# EAGLE design ACme++ (EAGLE 6.5.0)
AUTHOR: Brad Campbell; REV: A; TITLE: ACme++

## Sheet 1 of 4: EPIC & Programmer
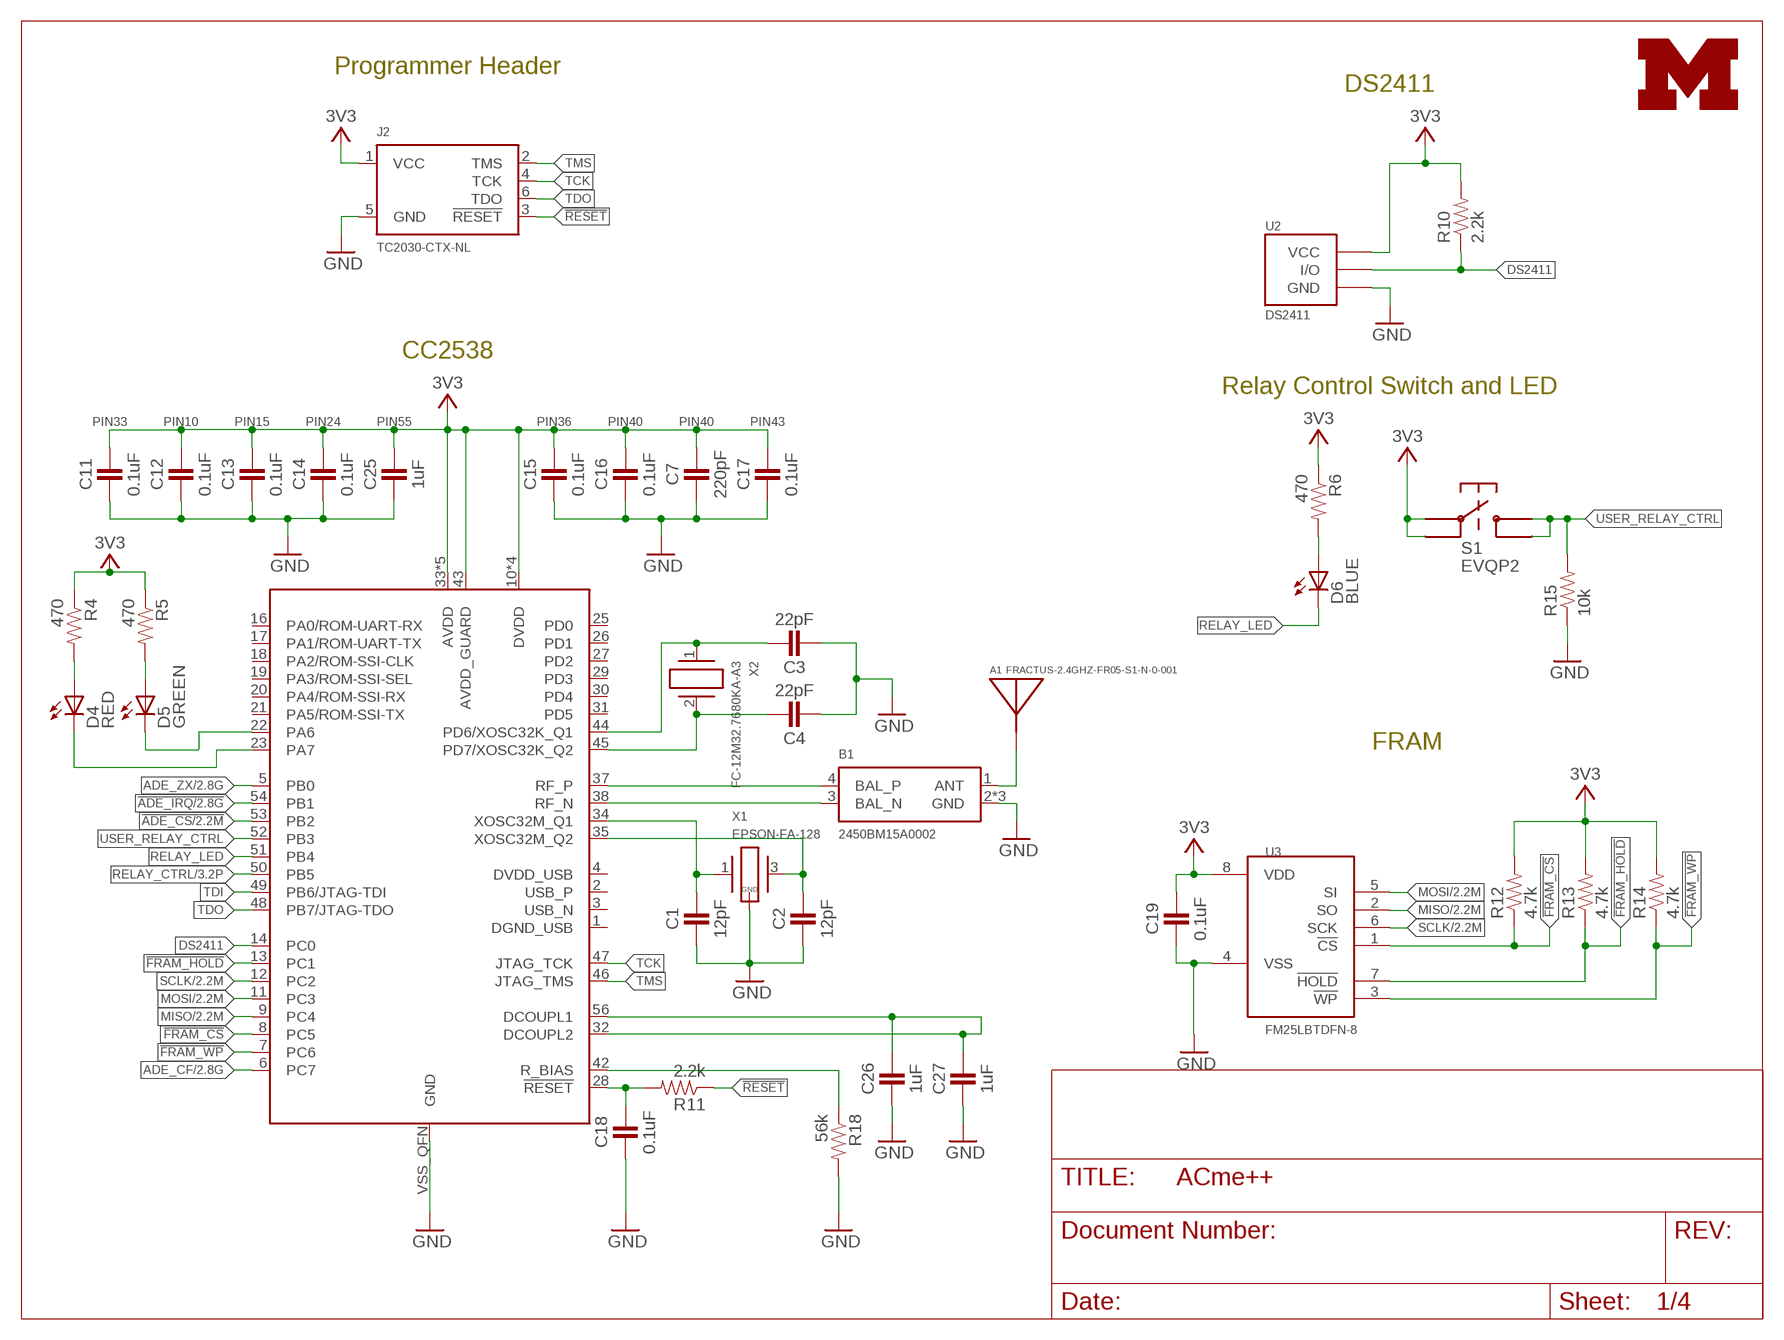
[diagram p0: schematic, sheet 1]

### Parts
A1  FRACTUS-2.4GHZ-FR05-S1-N-0-001  [FRACTUS-ANTENNA-FR05-S1-N-0-001]
B1  2450BM15A0002  [2450BM]
C1  12pF  CAPACITOR  [0402_CAP]
C2  12pF  CAPACITOR  [0402_CAP]
C3  22pF  CAPACITOR  [0402_CAP]
C4  22pF  CAPACITOR  [0402_CAP]
C7  220pF  CAPACITOR  [0402_CAP]
C11  0.1uF  CAPACITOR  [0402_CAP]
C12  0.1uF  CAPACITOR  [0402_CAP]
C13  0.1uF  CAPACITOR  [0402_CAP]
C14  0.1uF  CAPACITOR  [0402_CAP]
C15  0.1uF  CAPACITOR  [0402_CAP]
C16  0.1uF  CAPACITOR  [0402_CAP]
C17  0.1uF  CAPACITOR  [0402_CAP]
C18  0.1uF  CAPACITOR  [0402_CAP]
C19  0.1uF  CAPACITOR  [0402_CAP]
C25  1uF  CAPACITOR  [0402_CAP]
C26  1uF  CAPACITOR  [0402_CAP]
C27  1uF  CAPACITOR  [0402_CAP]
D4  RED  LED0603  [LED-0603]
D5  GREEN  LED0603  [LED-0603]
D6  BLUE  LED0603  [LED-0603]
J2  TC2030-CTX-NL  [TC2030-IDC-NL]
R4  470  RESISTOR  [0402_RES]
R5  470  RESISTOR  [0402_RES]
R6  470  RESISTOR  [0402_RES]
R10  2.2k  RESISTOR  [0402_RES]
R11  2.2k  RESISTOR  [0402_RES]
R12  4.7k  RESISTOR  [0402_RES]
R13  4.7k  RESISTOR  [0402_RES]
R14  4.7k  RESISTOR  [0402_RES]
R15  10k  RESISTOR0603-RES  [0603-RES]
R18  56k  RESISTOR  [0402_RES]
S1  EVQP2  [EVQP2]
U1  CC2538  [S-PVQFN-N56]
U2  DS2411  [SOT-23]
U3  FM25LBTDFN-8  [TDFN-8]
U$3  UMICH_SOLID_MEDIUM  [UMICH_SOLID_200MIL]
X1  EPSON-FA-128  [FA-128]
X2  FC-12M32.7680KA-A3  [FC-12M]

### Nets
3V3: C7.1 C11.1 C12.1 C13.1 C14.1 C15.1 C16.1 C17.1 C19.1 C25.1 J2.1(VCC) R4.1 R5.1 R6.1 R10.2 R12.2 R13.2 R14.2 S1.P$1 S1.P$3 U1.10(DVDD) U1.15(DVDD) U1.24(DVDD) U1.33(AVDD) U1.36(AVDD) U1.39(AVDD) U1.40(AVDD) U1.41(AVDD) U1.43(AVDD_GUARD) U1.55(DVDD) U2.2(VCC) U3.8(VDD) ; also sheet 2,3,4
!ADE_CS: U1.53(PB2) ; also sheet 2
!ADE_IRQ: U1.54(PB1) ; also sheet 2
!FRAM_CS: R12.1 U1.8(PC5) U3.1(!CS)
!FRAM_HOLD: R13.1 U1.13(PC1) U3.7(!HOLD)
!FRAM_WP: R14.1 U1.7(PC6) U3.3(!WP)
!RESET: J2.3(!RESET) R11.1
ADE_CF: U1.6(PC7) ; also sheet 2
ADE_ZX: U1.5(PB0) ; also sheet 2
ANTENNA: A1.1(ANTENNA) B1.1(ANT)
DS2411: R10.1 U1.14(PC0) U2.1(I/O)
GND: B1.2(GND) B1.5(GND) B1.6(GND) C1.2 C2.2 C3.2 C4.2 C7.2 C11.2 C12.2 C13.2 C14.2 C15.2 C16.2 C17.2 C18.2 C19.2 C25.2 C26.2 C27.2 J2.5(GND) R15.1 R18.2 U1.VSS_QFN(GND) U2.3(GND) U3.4(VSS) X1.2(GND) X1.4(GND) ; also sheet 2,3,4
GREEN_LED: D5.C U1.22(PA6)
MISO: U1.9(PC4) U3.2(SO) ; also sheet 2
MOSI: U1.11(PC3) U3.5(SI) ; also sheet 2
N$1: C26.1 C27.1 U1.32(DCOUPL2) U1.56(DCOUPL1)
N$2: C18.1 R11.2 U1.28(!RESET)
N$6: C4.1 U1.45(PD7/XOSC32K_Q2) X2.2
N$7: C3.1 U1.44(PD6/XOSC32K_Q1) X2.1
N$8: R18.1 U1.42(R_BIAS)
N$9: C1.1 U1.34(XOSC32M_Q1) X1.1
N$10: C2.1 U1.35(XOSC32M_Q2) X1.3
N$12: D6.A R6.2
N$20: D4.A R4.2
N$22: D5.A R5.2
RED_LED: D4.C U1.23(PA7)
RELAY_CTRL: U1.50(PB5) ; also sheet 3
RELAY_LED: D6.C U1.51(PB4)
RF_N: B1.3(BAL_N) U1.38(RF_N)
RF_P: B1.4(BAL_P) U1.37(RF_P)
SCLK: U1.12(PC2) U3.6(SCK) ; also sheet 2
TCK: J2.4(TCK) U1.47(JTAG_TCK)
TDI: U1.49(PB6/JTAG-TDI)
TDO: J2.6(TDO) U1.48(PB7/JTAG-TDO)
TMS: J2.2(TMS) U1.46(JTAG_TMS)
USER_RELAY_CTRL: R15.2 S1.P$2 S1.P$4 U1.52(PB3)
Unconnected: U1.1(DGND_USB) U1.2(USB_P) U1.3(USB_N) U1.4(DVDD_USB) U1.16(PA0/ROM-UART-RX) U1.17(PA1/ROM-UART-TX) U1.18(PA2/ROM-SSI-CLK) U1.19(PA3/ROM-SSI-SEL) U1.20(PA4/ROM-SSI-RX) U1.21(PA5/ROM-SSI-TX) U1.25(PD0) U1.26(PD1) U1.27(PD2) U1.29(PD3) U1.30(PD4) U1.31(PD5)

### Notes on the sheet
- Programmer Header
- DS2411
- CC2538
- Relay Control Switch and LED
- PIN33 | PIN10 | PIN15 | PIN24 | PIN55 | PIN36 | PIN40 | PIN40 | PIN43
- FRAM

## Sheet 2 of 4: ADE7753
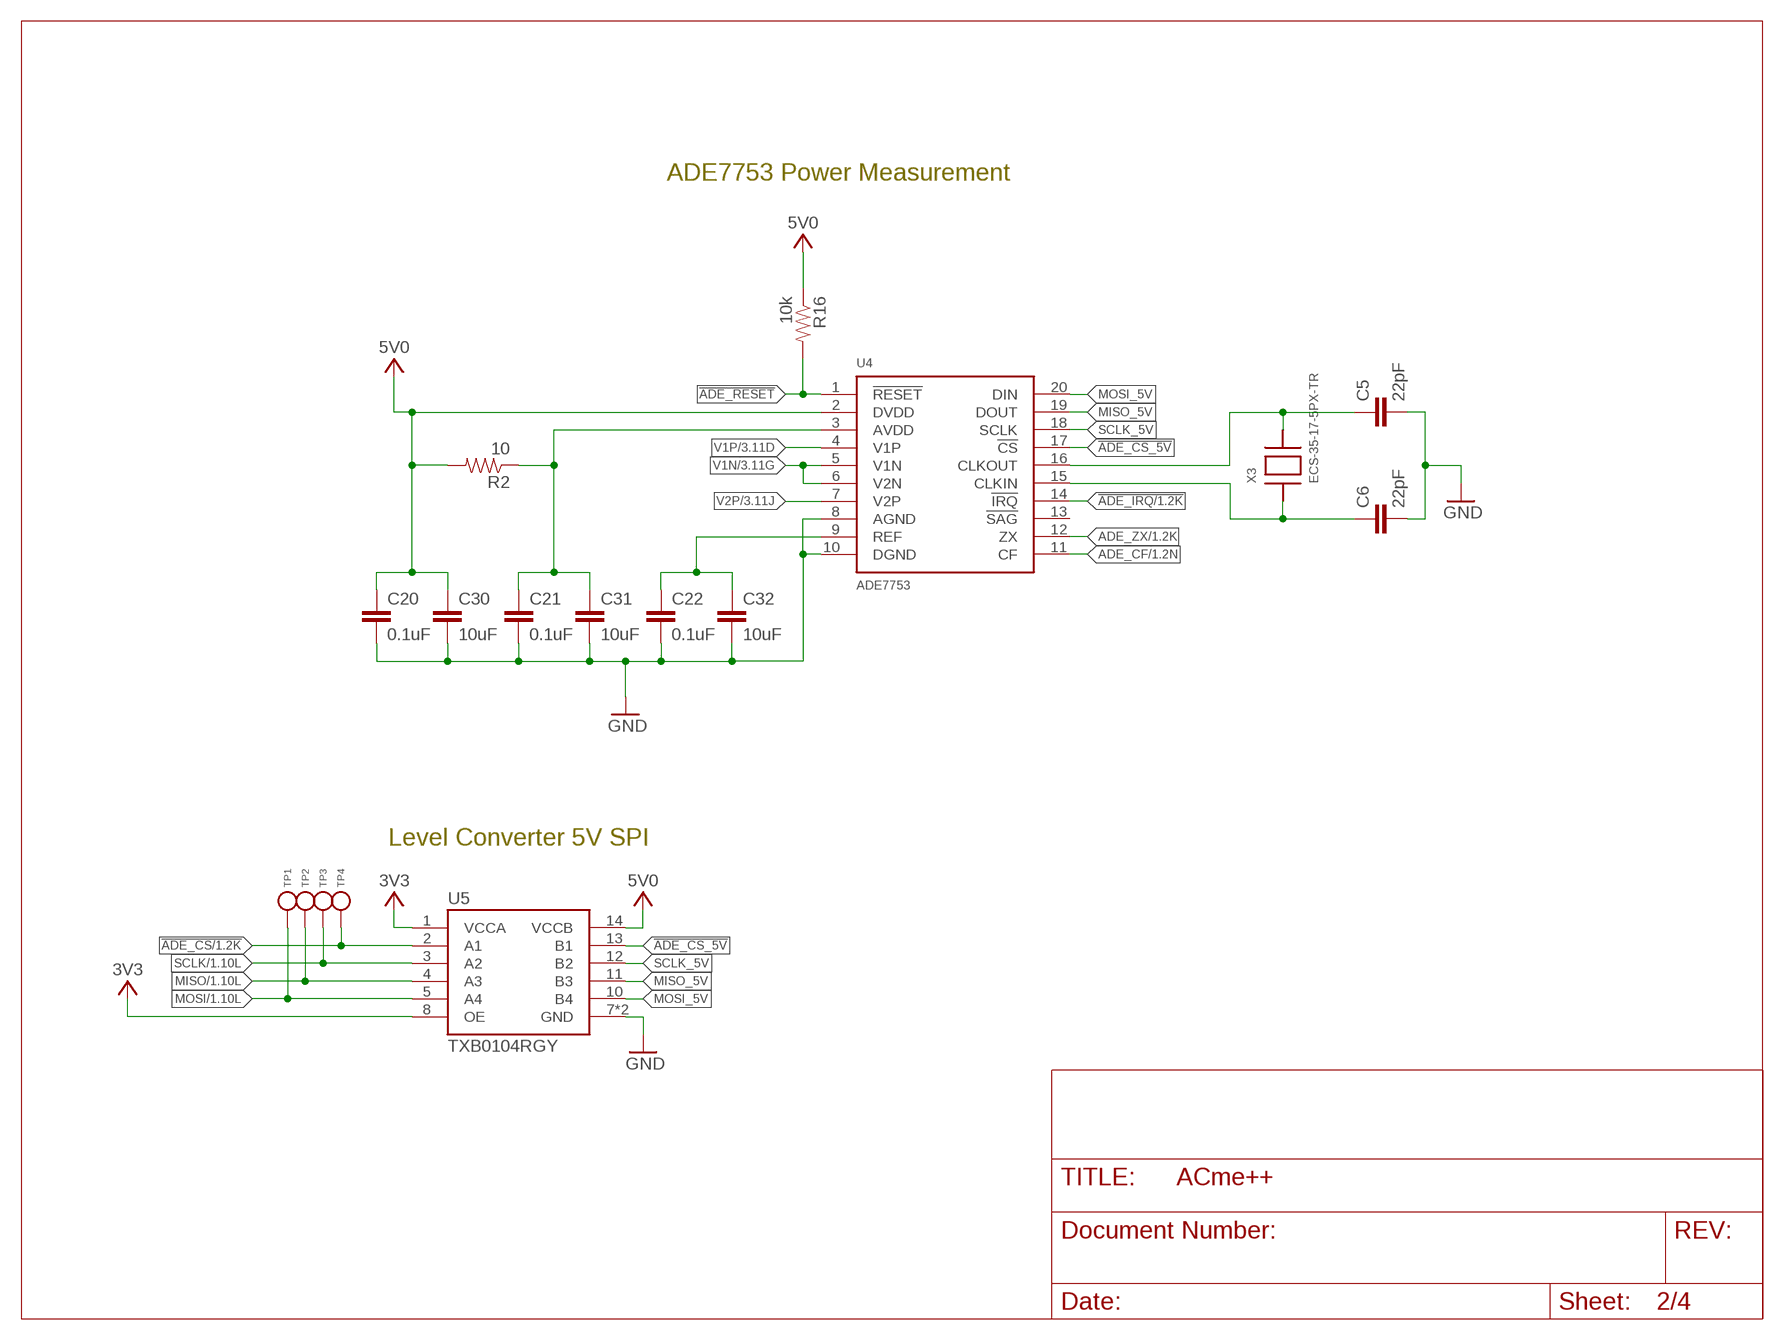
[diagram p1: schematic, sheet 2]

### Parts
C5  22pF  CAP0603-CAP  [0603-CAP]
C6  22pF  CAP0603-CAP  [0603-CAP]
C20  0.1uF  CAP0603-CAP  [0603-CAP]
C21  0.1uF  CAP0603-CAP  [0603-CAP]
C22  0.1uF  CAP0603-CAP  [0603-CAP]
C30  10uF  CAP0603-CAP  [0603-CAP]
C31  10uF  CAP0603-CAP  [0603-CAP]
C32  10uF  CAP0603-CAP  [0603-CAP]
R2  10  RESISTOR0603-RES  [0603-RES]
R16  10k  RESISTOR0603-RES  [0603-RES]
TP1  TEST_POINT_0.040IN  [TESTPOINT_0.040IN]
TP2  TEST_POINT_0.040IN  [TESTPOINT_0.040IN]
TP3  TEST_POINT_0.040IN  [TESTPOINT_0.040IN]
TP4  TEST_POINT_0.040IN  [TESTPOINT_0.040IN]
U4  ADE7753  [SSOP-20]
U5  TXB0104RGY  [S-PVQFN-N14]
X3  ECS-35-17-5PX-TR  [CSM-7X]

### Nets
3V3: U5.1(VCCA) U5.8(OE) ; also sheet 1,3,4
5V0: C20.1 C30.1 R2.2 R16.1 U4.2(DVDD) U5.14(VCCB) ; also sheet 3,4
!ADE_CS: TP4.TESTPOINT U5.2(A1) ; also sheet 1
!ADE_CS_5V: U4.17(!CS) U5.13(B1)
!ADE_IRQ: U4.14(!IRQ) ; also sheet 1
!ADE_RESET: R16.2 U4.1(!RESET)
ADE_AVDD: C21.1 C31.1 R2.1 U4.3(AVDD)
ADE_CF: U4.11(CF) ; also sheet 1
ADE_ZX: U4.12(ZX) ; also sheet 1
GND: C5.2 C6.2 C20.2 C21.2 C22.2 C30.2 C31.2 C32.2 U4.8(AGND) U4.10(DGND) U5.7(GND) U5.THERMALPAD(GND) ; also sheet 1,3,4
MISO: TP2.TESTPOINT U5.4(A3) ; also sheet 1
MISO_5V: U4.19(DOUT) U5.11(B3)
MOSI: TP1.TESTPOINT U5.5(A4) ; also sheet 1
MOSI_5V: U4.20(DIN) U5.10(B4)
N$3: C6.1 U4.15(CLKIN) X3.1
N$11: C22.1 C32.1 U4.9(REF)
N$15: C5.1 U4.16(CLKOUT) X3.2
SCLK: TP3.TESTPOINT U5.3(A2) ; also sheet 1
SCLK_5V: U4.18(SCLK) U5.12(B2)
V1N: U4.5(V1N) U4.6(V2N) ; also sheet 3
V1P: U4.4(V1P) ; also sheet 3
V2P: U4.7(V2P) ; also sheet 3
Unconnected: U4.13(!SAG)

### Notes on the sheet
- ADE7753 Power Measurement
- Level Converter 5V SPI

## Sheet 3 of 4: Relay
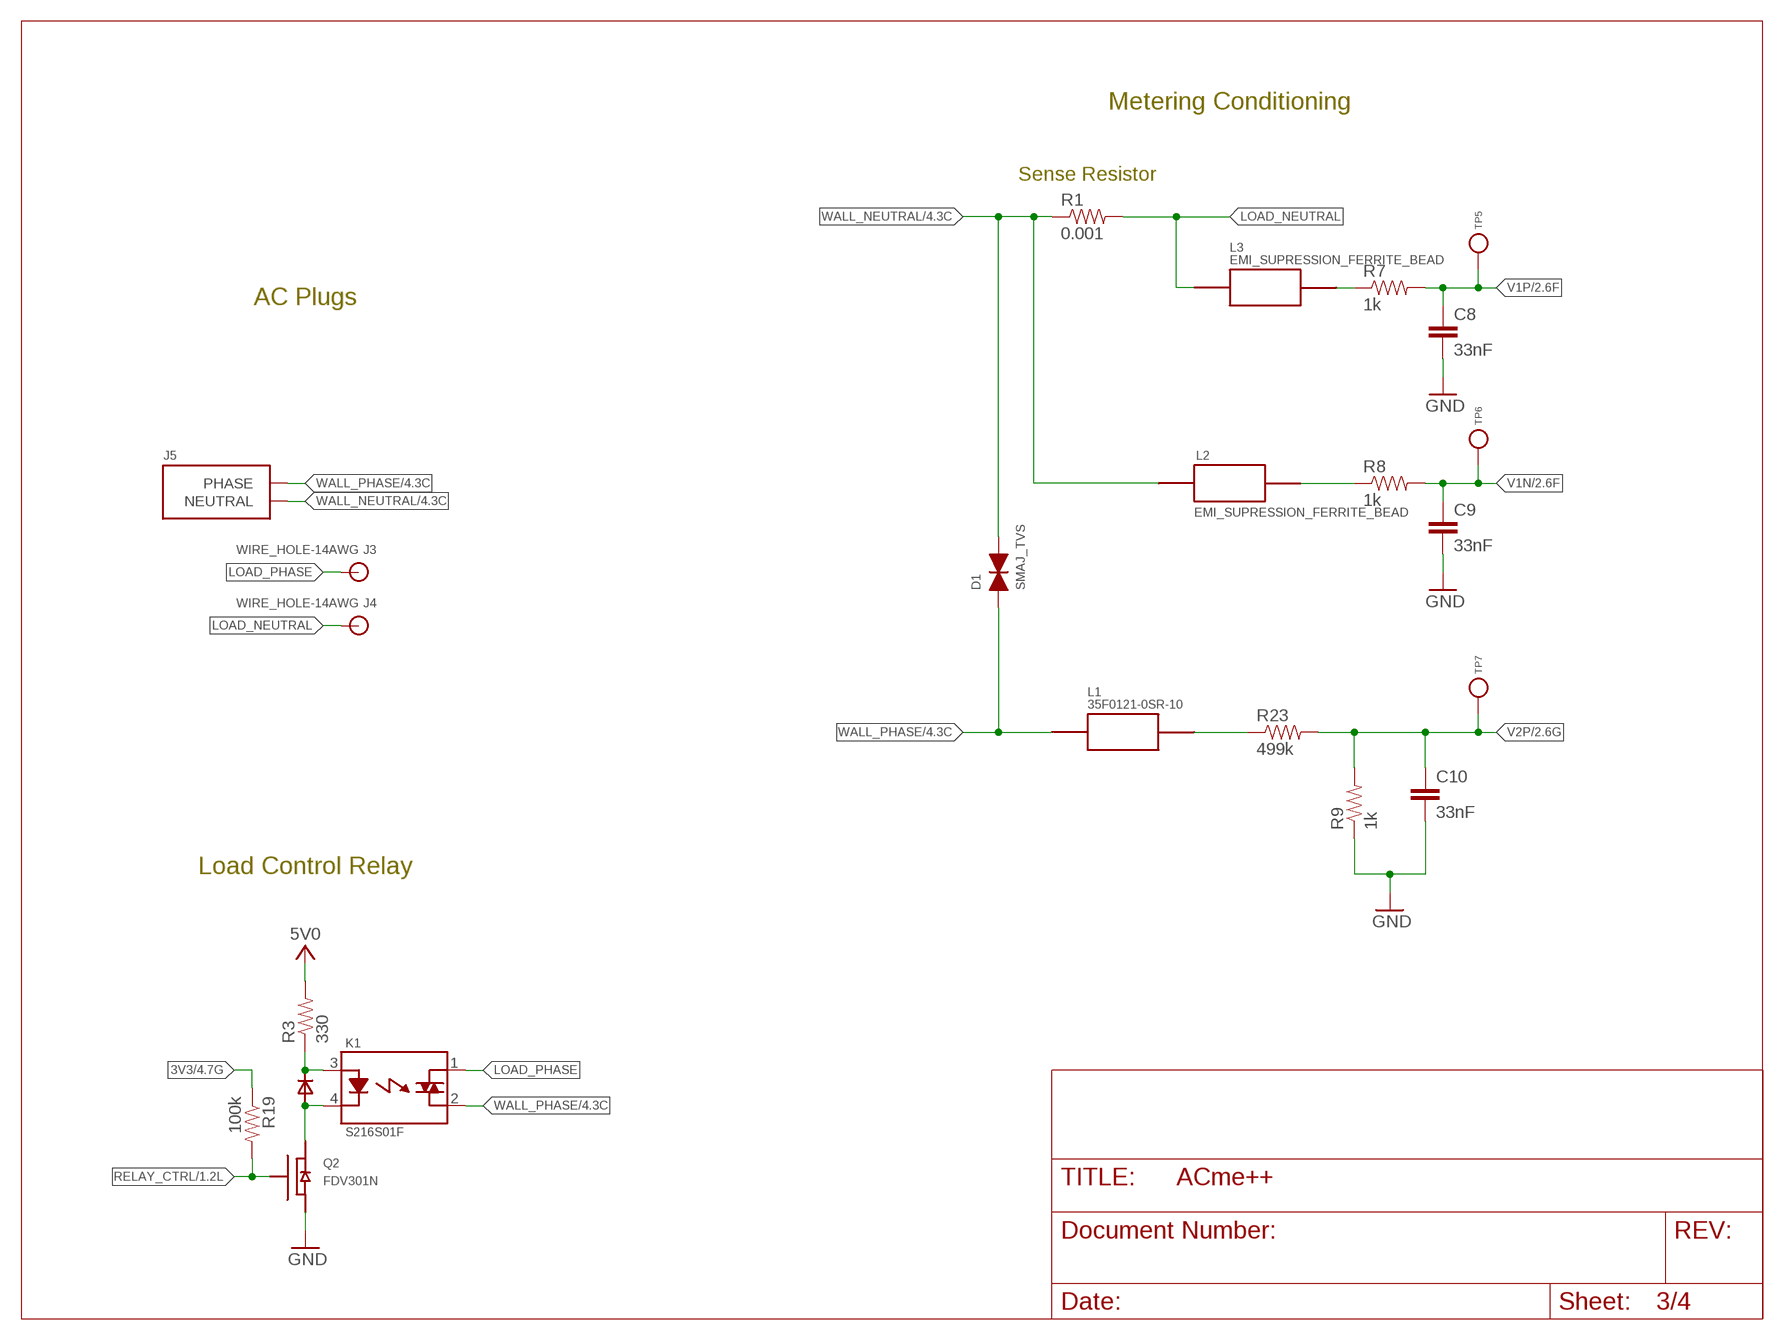
[diagram p2: schematic, sheet 3]

### Parts
C8  33nF  CAP0805  [0805]
C9  33nF  CAP0805  [0805]
C10  33nF  CAP0805  [0805]
D1  SMAJ_TVS  [DO214_TVS]
D3  DIODE_MMBD914  [SOT-23]
J3  WIRE_HOLE-14AWG  [WIRE_HOLE-14AWG]
J4  WIRE_HOLE-14AWG  [WIRE_HOLE-14AWG]
J5  AC-PLUG-2  [AC_MALE_PINS_2]
K1  S216S01F  [RELAY_SX16S0X]
L1  35F0121-0SR-10  [35F0102]
L2  EMI_SUPRESSION_FERRITE_BEAD  [L1806]
L3  EMI_SUPRESSION_FERRITE_BEAD  [L1806]
Q2  FDV301N  [SOT-23]
R1  0.001  RESISTOR2512  [R2512]
R3  330  RESISTOR0805-RES  [0805]
R7  1k  RESISTOR0805-RES  [0805]
R8  1k  RESISTOR0805-RES  [0805]
R9  1k  RESISTOR0805-RES  [0805]
R19  100k  RESISTOR0603-RES  [0603-RES]
R23  499k  RESISTOR0805-RES  [0805]
TP5  TEST_POINT_0.040IN  [TESTPOINT_0.040IN]
TP6  TEST_POINT_0.040IN  [TESTPOINT_0.040IN]
TP7  TEST_POINT_0.040IN  [TESTPOINT_0.040IN]

### Nets
3V3: R19.1 ; also sheet 1,2,4
5V0: R3.2 ; also sheet 2,4
GND: C8.2 C9.2 C10.2 Q2.2(S) R9.1 ; also sheet 1,2,4
LOAD_NEUTRAL: J4.P$1 L3.P$1 R1.2
LOAD_PHASE: J3.P$1 K1.1
N$4: D3.1 K1.4 Q2.3(D)
N$13: D3.3 K1.3 R3.1
N$14: L2.P$2 R8.1
N$16: L3.P$2 R7.1
N$17: L1.2 R23.1
RELAY_CTRL: Q2.1(G) R19.2 ; also sheet 1
V1N: C9.1 R8.2 TP6.TESTPOINT ; also sheet 2
V1P: C8.1 R7.2 TP5.TESTPOINT ; also sheet 2
V2P: C10.1 R9.2 R23.2 TP7.TESTPOINT ; also sheet 2
WALL_NEUTRAL: D1.CATHODE J5.NEUTRAL1(NEUTRAL) J5.NEUTRAL2(NEUTRAL) L2.P$1 R1.1 ; also sheet 4
WALL_PHASE: D1.ANODE J5.PHASE1(PHASE) J5.PHASE2(PHASE) K1.2 L1.1 ; also sheet 4

### Notes on the sheet
- Metering Conditioning
- Sense Resistor
- AC Plugs
- Load Control Relay

## Sheet 4 of 4: AC-DC
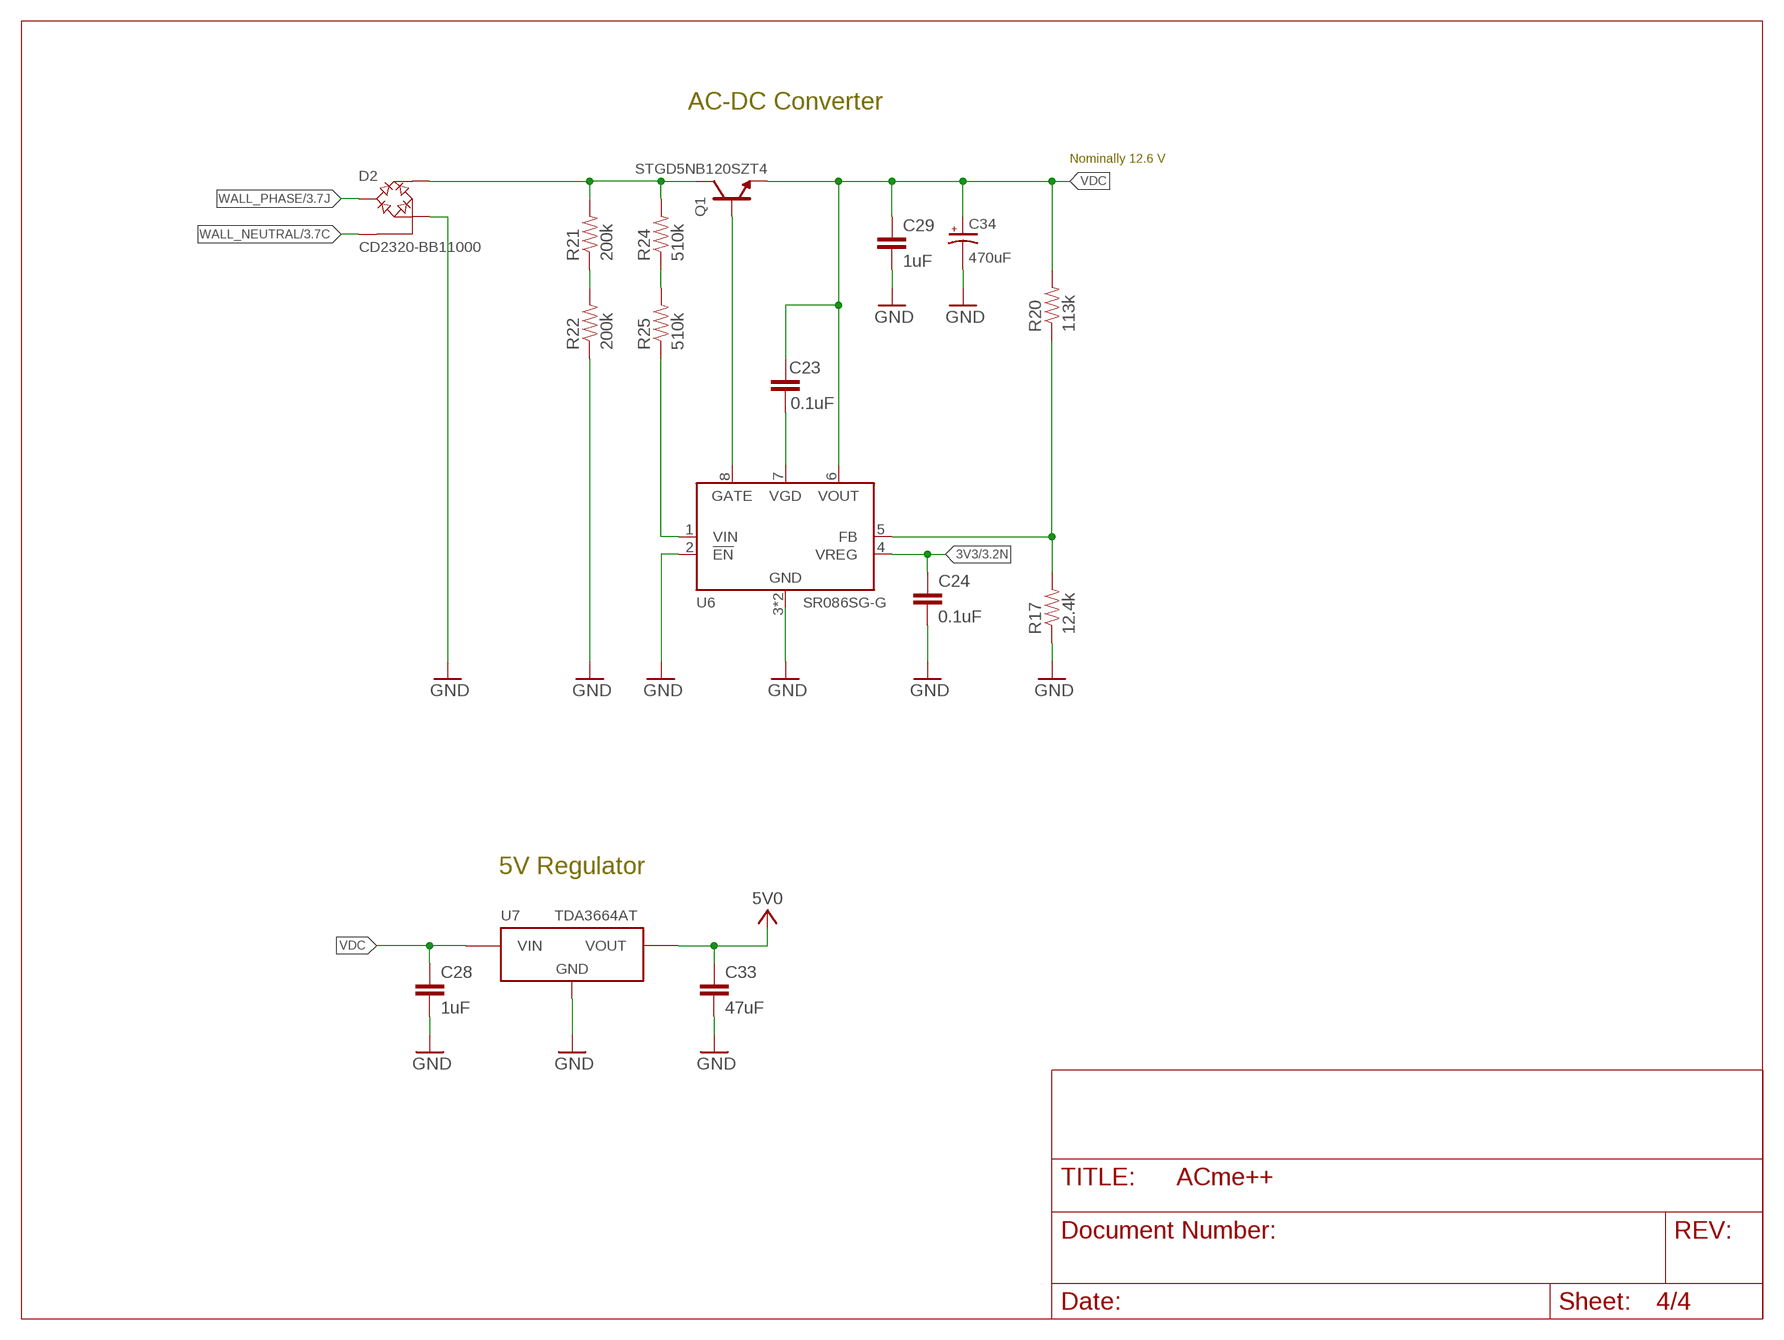
[diagram p3: schematic, sheet 4]

### Parts
C23  0.1uF  CAP0603-CAP  [0603-CAP]
C24  0.1uF  CAP0603-CAP  [0603-CAP]
C28  1uF  CAP0603-CAP  [0603-CAP]
C29  1uF  CAP1206  [1206]
C33  47uF  CAP1206  [1206]
C34  470uF  CAP_EEE-FP1E471AP  [CAP_SM_10MM]
D2  CD2320-BB11000  [CD2320]
Q1  STGD5NB120SZT4  [DPAK]
R17  12.4k  RESISTOR0603-RES  [0603-RES]
R20  113k  RESISTOR0603-RES  [0603-RES]
R21  200k  RESISTOR1206  [1206]
R22  200k  RESISTOR1206  [1206]
R24  510k  RESISTOR1206  [1206]
R25  510k  RESISTOR1206  [1206]
U6  SR086SG-G  [SR086]
U7  TDA3664AT  [SOIC_8]

### Nets
3V3: C24.1 U6.4(VREG) ; also sheet 1,2,3
5V0: C33.1 U7.1(VOUT) ; also sheet 2,3
DC_RECTIFIED: D2.3(POS) Q1.P$2(C) R21.2 R24.2
GND: C24.2 C28.2 C29.2 C33.2 C34.- D2.4(NEG) R17.1 R22.1 U6.2(!EN) U6.3(GND) U6.PAD(GND) U7.3(GND) ; also sheet 1,2,3
N$18: R21.1 R22.2
N$21: R24.1 R25.2
N$24: C23.2 U6.7(VGD)
N$26: R17.2 R20.1 U6.5(FB)
SR086_GATE: Q1.P$1(G) U6.8(GATE)
SR086_VIN: R25.1 U6.1(VIN)
VDC: C23.1 C28.1 C29.1 C34.+ Q1.P$3(E) R20.2 U6.6(VOUT) U7.8(VIN)
WALL_NEUTRAL: D2.2(AC2) ; also sheet 3
WALL_PHASE: D2.1(AC1) ; also sheet 3

### Notes on the sheet
- AC-DC Converter
- Nominally 12.6 V
- 5V Regulator

## Library data of the parts
A1 = chips:FRACTUS-2.4GHZ-FR05-S1-N-0-001: Fractus Reach Xtend Bluetooth®, Zigbee®, 802.11 b/g/n WLAN Chip Antenna; RICHARDSON_RFPD: FR05-S1-N-0001B
B1 = chips:2450BM15A0002: BALUN JTI MATCHED ZIGBEE; DIGIKEY: 712-1536-1-ND
C1 C2 = passives:CAPACITOR: 0402 Capacitor; DIGIKEY: 445-1236-1-ND
C3 C4 = passives:CAPACITOR: 0402 Capacitor; DIGIKEY: 490-5868-1-ND
C5 C6 = SparkFun-Passives:CAP: Capacitor Standard 0603 ceramic capacitor, and 0.1" leaded capacitor.; DIGIKEY: 445-1273-1-ND
C7 = passives:CAPACITOR: 0402 Capacitor; DIGIKEY: 445-1251-1-ND
C8-C10 = SparkFun-Passives:CAP: Capacitor Standard 0603 ceramic capacitor, and 0.1" leaded capacitor.; DIGIKEY: 478-1389-1-ND
C11-C19 = passives:CAPACITOR: 0402 Capacitor; DIGIKEY: 445-1265-1-ND
C20-C24 = SparkFun-Passives:CAP: Capacitor Standard 0603 ceramic capacitor, and 0.1" leaded capacitor.; DIGIKEY: 445-1316-1-ND
C25-C27 = passives:CAPACITOR: 0402 Capacitor; DIGIKEY: 445-4998-1-ND
C28 = SparkFun-Passives:CAP: Capacitor Standard 0603 ceramic capacitor, and 0.1" leaded capacitor.; DIGIKEY: 445-5956-1-ND
C29 = SparkFun-Passives:CAP: Capacitor Standard 0603 ceramic capacitor, and 0.1" leaded capacitor.; DIGIKEY: 445-1381-1-ND
C30-C32 = SparkFun-Passives:CAP: Capacitor Standard 0603 ceramic capacitor, and 0.1" leaded capacitor.; DIGIKEY: 1276-1119-1-ND
C33 = SparkFun-Passives:CAP: Capacitor Standard 0603 ceramic capacitor, and 0.1" leaded capacitor.; DIGIKEY: 399-5508-1-ND
C34 = powercube:CAP_EEE-FP1E471AP: Surface mount low ESR cap.; DIGIKEY: PCE4440CT-ND
D1 = powercube:SMAJ_TVS; DIGIKEY: SMAJ250CALFCT-ND
D2 = powercube:CD2320-B: Bridge rectifier; DIGIKEY: CD2320-B11000CT-ND
D3 = powercube:DIODE_MMBD914: DIODE SML SIG 100V 0.2A SOT23-3; DIGIKEY: MMBD914FSCT-ND
D4 = SparkFun-LED:LED: LEDs Standard schematic elements and footprints for 5mm, 3mm, 1206, and 0603 sized LEDs. 5mm - Spark Fun Electronics SKU : COM-00529 (and others); DIGIKEY: 160-1835-1-ND
D5 = SparkFun-LED:LED: LEDs Standard schematic elements and footprints for 5mm, 3mm, 1206, and 0603 sized LEDs. 5mm - Spark Fun Electronics SKU : COM-00529 (and others); DIGIKEY: 160-1834-1-ND
D6 = SparkFun-LED:LED: LEDs Standard schematic elements and footprints for 5mm, 3mm, 1206, and 0603 sized LEDs. 5mm - Spark Fun Electronics SKU : COM-00529 (and others); DIGIKEY: 160-1837-1-ND
J2 = connector:TC2030-CTX: Tag Connect footprint for ARM JTAG. 10 pin ARM Cortex Debug Connector.
J3 J4 = powercube:WIRE_HOLE-14AWG: Solder point for 14AWG wire
J5 = powercube:AC-PLUG-2: For use with Bud Industries Box: 377-1709-ND
K1 = powercube:S216S01F: RELAY SSR 240VAC 16A TRIAC 4-SIP; DIGIKEY: 425-2413-5-ND; MOUSER: 852-S216S01F; NEWARK: 14N9591
L1 = powercube:35F0121-0SR-10: FERRITE 10A 42 OHMS @ 10 MHZ SMD; DIGIKEY: 240-2520-1-ND
L2 L3 = powercube:EMI_SUPRESSION_FERRITE_BEAD: FERRITE 300MA 150 OHM 1806 SMD; DIGIKEY: 240-2418-1-ND
Q1 = powercube:STGD5NB120SZ: 5 A - 1200 V - low drop internally clamped IGBT; DIGIKEY: 497-4352-1-ND
Q2 = powercube:FDV301N; DIGIKEY: FDV301NCT-ND
R1 = SparkFun-Resistors:RESISTOR: Resistor; DIGIKEY: P1.0TCT-ND
R2 = SparkFun:RESISTOR: Resistor; DIGIKEY: RHM10.0CFCT-ND
R3 = SparkFun-Resistors:RESISTOR: Resistor; DIGIKEY: RHM330KCT-ND
R4-R6 = passives:RESISTOR: Resistor; DIGIKEY: RHM470BHCT-ND
R7-R9 = SparkFun-Resistors:RESISTOR: Resistor; DIGIKEY: P16058CT-ND
R10 R11 = passives:RESISTOR: Resistor; DIGIKEY: RHM2.2KCECT-ND
R12-R14 = passives:RESISTOR: Resistor; DIGIKEY: RHM4.7KCECT-ND
R15 R16 = SparkFun:RESISTOR: Resistor; DIGIKEY: RHM10.0KCFCT-ND
R17 = SparkFun-Resistors:RESISTOR: Resistor; DIGIKEY: RHM12.4KCFCT-ND
R18 = passives:RESISTOR: Resistor; DIGIKEY: RHM56KBHCT-ND
R19 = SparkFun:RESISTOR: Resistor; DIGIKEY: RHM100KCGCT-ND
R20 = SparkFun-Resistors:RESISTOR: Resistor; DIGIKEY: RHM113KCFCT-ND
R21 R22 = SparkFun-Resistors:RESISTOR: Resistor; DIGIKEY: P200KALCT-ND
R23 = SparkFun-Resistors:RESISTOR: Resistor; DIGIKEY: P499KCCT-ND
R24 R25 = SparkFun-Resistors:RESISTOR: Resistor; DIGIKEY: P510KALCT-ND
S1 = epic:EVQP2; DIGIKEY: P11084SCT-ND
TP1-TP7 = headers:TEST_POINT_0.040IN: 0.040in Test Point; DIGIKEY: 5001K-ND
U1 = chips:CC2538: A Powerful System-On-Chip for 2.4-GHz IEEE 802.15.4, 6LoWPAN and ZigBee Applications; DIGIKEY: 296-35797-1-ND; MOUSER: 595-CC2538SF53RTQT; NEWARK: 87W7713
U2 = chips:DS2411: Maxim DS2411 Silicon Serial Number with VCC Input; DIGIKEY: DS2411R+CT-ND
U3 = chips:FM25LB: IC FRAM 4KBIT 10MHZ 8SOIC; DIGIKEY: FM25L04B-DGRA-ND; MOUSER: 877-FM25L04B-DG
U4 = powercube:ADE7753: Single-Phase Multifunction Metering IC; DIGIKEY: ADE7753ARSZRLCT-ND; MOUSER: 584-ADE7753ARSZR; NEWARK: 59K0984
U5 = chips:TXB0104: 4-BIT BIDIRECTIONAL VOLTAGE-LEVEL TRANSLATOR; DIGIKEY: 296-21930-1-ND
U6 = powercube:SR086: Adjustable Off-Line Inductorless Switching Regulator; MOUSER: 689-SR086SG-G
U7 = powercube:TDA3664: Very low dropout voltage/quiescent current 5 V voltage regulator; DIGIKEY: 568-3310-1-ND; MOUSER: 771-TDA3664ATN1118
U$3 = logos:UMICH_SOLID
X1 = crystals:EPSON-FA-128: MHz RANGE CRYSTAL UNIT ULTRA MINIATURE SIZE LOW PROFILE SMD http://www.digikey.com/product-search/en?FV=ffec63d1; DIGIKEY: SER3800CT-ND; MOUSER: 732-FA128-32F20X-K3
X2 = crystals:FC-12M: kHz RANGE CRYSTAL UNIT; DIGIKEY: SER3672CT-ND
X3 = powercube:ECS-35-17-5PX-TR: CRYSTAL 3.579545MHZ 17PF SMD; DIGIKEY: XC1234CT-ND

## Net classes
1 ac phase: width 2.032 mm, drill 1.524 mm

## Board
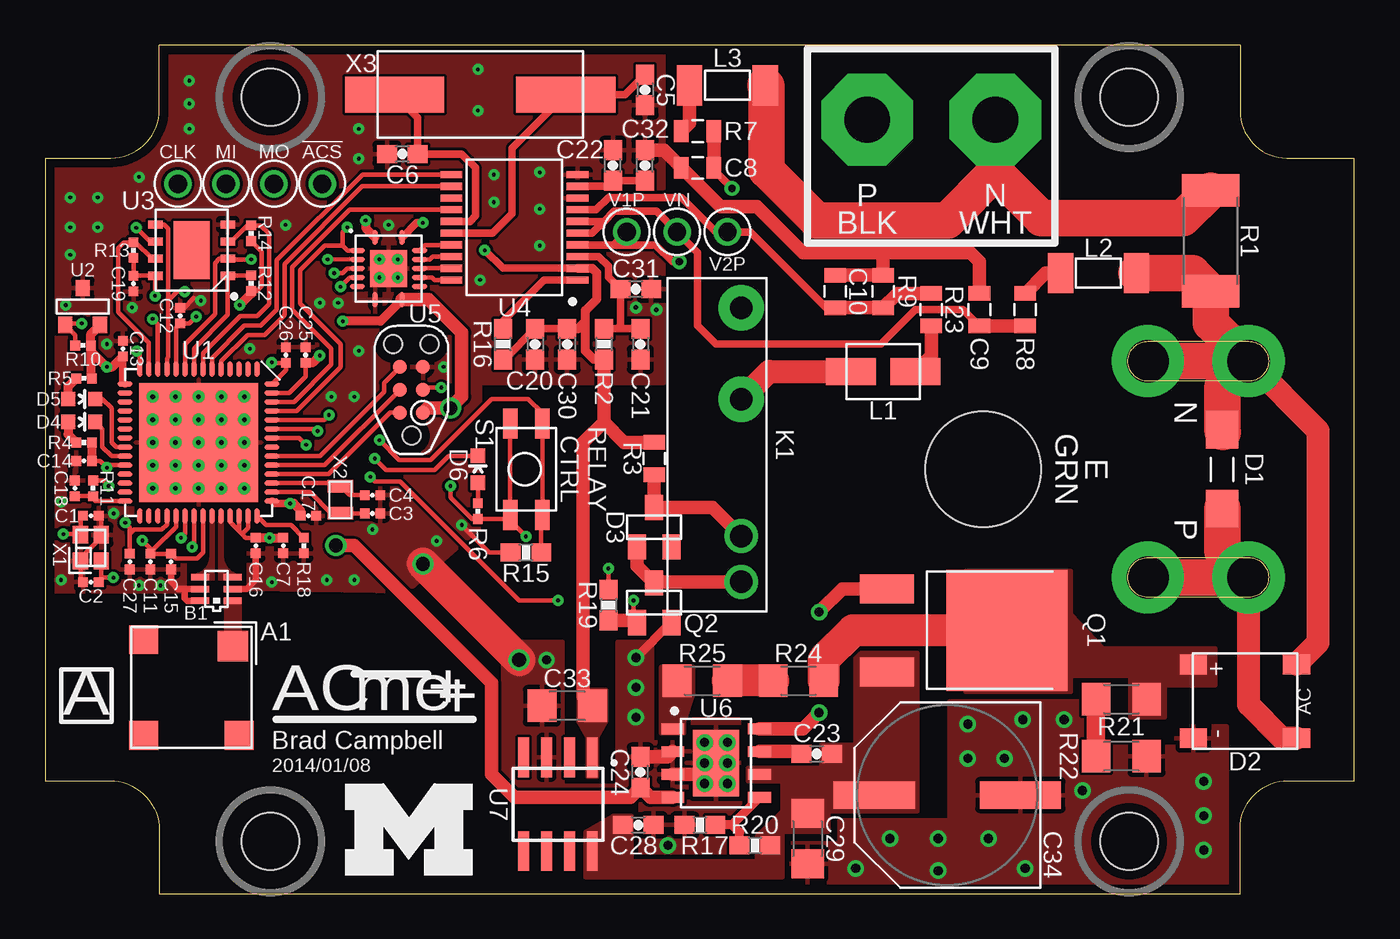
[diagram p4: board, top side]
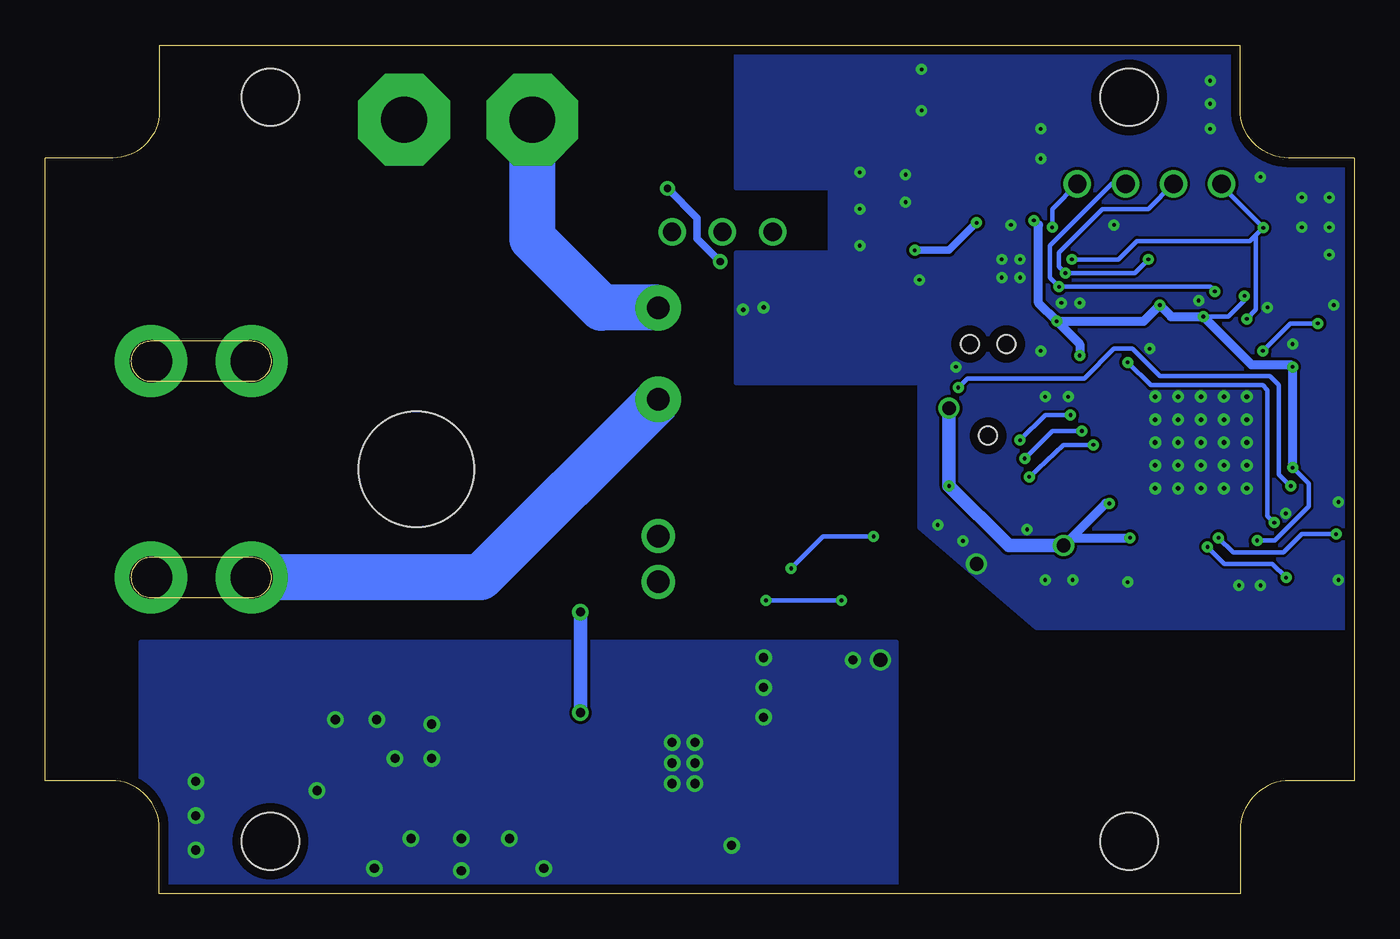
[diagram p5: board, bottom side, seen from below]

Size 72.62 x 47.07 mm. Coordinates in mm from the lower left corner, seen from the top.
Outline: 6.34,0 66.28,0 66.28,3.6 arc-90 68.94,6.26 72.62,6.26 72.62,40.8 68.87,40.8 arc-90 66.28,43.39 66.28,47.07 6.34,47.07 6.34,43.49 arc-90 3.65,40.8 0,40.8 0,6.26 3.58,6.26 arc-90 6.34,3.51 6.34,0
Copper layers (1*16): Top 0.0178mm / dielectric 59mil / Bottom 0.0178mm
Design rules "sunstone-2lyr_v1.0.0.3 *": minimum track width 6mil, minimum drill 14mil, track to track 6mil, track to pad 6mil, pad to pad 6mil, via to via 6mil, smd to smd 6mil, copper to edge 20mil, drill to drill 16mil, minimum pad ring 8mil, minimum via ring 8mil, stop-mask expansion 3mil, vias tented up to drill 100mil, thermal gap 10mil
Holes 3.17 mm at 12.5,44.17 12.5,2.9 60.12,2.9 60.12,44.17

### Footprints (pad centres in the part's own frame; a part is rotated, then mirrored left to right if it is on the bottom)
FRACTUS-ANTENNA-FR05-S1-N-0-001 = smd 1.7 x 1.7: 1 2.3,-2.3 | smd 1.6 x 1.6: 2 2.65,2.65; 3 -2.65,-2.65; 4 -2.65,2.65
2450BM = smd 0.35 x 1: 1 0.65,0.9; 2 0,0.9; 3 -0.65,0.9; 4 -0.65,-0.9; 5 0,-0.9; 6 0.65,-0.9
0402_CAP = smd 0.536 x 0.546: 1 -0.433,0; 2 0.433,0
0603-CAP = smd 1.1 x 1: 1 -0.85,0; 2 0.85,0
0805 = smd 0.8 x 1.2: 1 -0.9,0; 2 0.9,0
1206 = smd 1.6 x 1.8: 1 -1.4,0; 2 1.4,0
CAP_SM_10MM = smd 1.5 x 4.5: + 0,4.05; - 0,-4.05
DO214_TVS = smd 2.083 x 1.778: ANODE 2.184,0; CATHODE -2.184,0
CD2320 = smd 1.1 x 1.5: 1 -2.05,-2.86; 2 2.05,-2.86; 3 2.05,2.86; 4 -2.05,2.86
SOT-23 = smd 1 x 1.4: 1 -0.95,-1.1; 2 0.95,-1.1; 3 0,1.1
LED-0603 = smd 0.8 x 0.8: A 0,-0.75; C 0,0.75
TC2030-IDC-NL = smd 0.787 x 0.787: 1 -1.27,-0.635; 2 -1.27,0.635; 3 0,-0.635; 4 0,0.635; 5 1.27,-0.635; 6 1.27,0.635 | hole 1.016: -2.54,0; 2.54,1.016; 2.54,-1.016
WIRE_HOLE-14AWG = drill 2.54 pad 5.08 octagon: P$1 0,0
AC_MALE_PINS_2 = drill 2.34 pad 4: NEUTRAL1 -2.79,-5.995; NEUTRAL2 2.79,-5.995; PHASE1 -2.79,5.995; PHASE2 2.79,5.995 | hole 6.426: 11.938,0
RELAY_SX16S0X = drill 1.25 pad 2.54: 1 -7.602,0; 2 -2.522,0 | drill 1.25: 3 5.062,0; 4 7.602,0
35F0102 = smd 2.769 x 1.473: 1 -1.791,0; 2 1.791,0
L1806 = smd 1.4 x 2.24: P$1 -2.1,0; P$2 2.1,0
DPAK = smd 1.6 x 3: P$1 -2.3,-6.65; P$3 2.3,-6.65 | smd 6.7 x 6.7: P$2 0,0
R2512 = smd 1.8 x 3.2: 1 -2.8,0; 2 2.8,0
0603-RES = smd 1.1 x 1: 1 -0.85,0; 2 0.85,0
0402_RES = smd 0.536 x 0.546: 1 -0.433,0; 2 0.433,0
EVQP2 = smd 1.676 x 0.813: P$1 -2.54,-0.87; P$2 -2.54,0.908; P$3 2.54,-0.87; P$4 2.54,0.908
TESTPOINT_0.040IN = drill 1.016: TESTPOINT 0,0
S-PVQFN-N56 = smd 0.85 x 0.28: 1 -4.075,3.25; 2 -4.075,2.75; 3 -4.075,2.25; 4 -4.075,1.75; 5 -4.075,1.25; 6 -4.075,0.75; 7 -4.075,0.25; 8 -4.075,-0.25; 9 -4.075,-0.75; 10 -4.075,-1.25; 11 -4.075,-1.75; 12 -4.075,-2.25; 13 -4.075,-2.75; 14 -4.075,-3.25; 29 4.075,-3.25; 30 4.075,-2.75; 31 4.075,-2.25; 32 4.075,-1.75; 33 4.075,-1.25; 34 4.075,-0.75; 35 4.075,-0.25; 36 4.075,0.25; 37 4.075,0.75; 38 4.075,1.25; 39 4.075,1.75; 40 4.075,2.25; 41 4.075,2.75; 42 4.075,3.25 | smd 0.28 x 0.85: 15 -3.25,-4.075; 16 -2.75,-4.075; 17 -2.25,-4.075; 18 -1.75,-4.075; 19 -1.25,-4.075; 20 -0.75,-4.075; 21 -0.25,-4.075; 22 0.25,-4.075; 23 0.75,-4.075; 24 1.25,-4.075; 25 1.75,-4.075; 26 2.25,-4.075; 27 2.75,-4.075; 28 3.25,-4.075; 43 3.25,4.075; 44 2.75,4.075; 45 2.25,4.075; 46 1.75,4.075; 47 1.25,4.075; 48 0.75,4.075; 49 0.25,4.075; 50 -0.25,4.075; 51 -0.75,4.075; 52 -1.25,4.075; 53 -1.75,4.075; 54 -2.25,4.075; 55 -2.75,4.075; 56 -3.25,4.075 | smd 6.6 x 6.6: VSS_QFN 0,0
SOT-23' = smd 0.787 x 0.889: 1 0.991,1.016; 2 -0.94,1.016; 3 0.025,-1.016
TDFN-8 = smd 0.45 x 0.8: 1 -1.425,-2.007; 2 -0.475,-2.007; 3 0.475,-2.007; 4 1.425,-2.007; 5 1.425,2.007; 6 0.475,2.007; 7 -0.475,2.007; 8 -1.425,2.007 | smd 3.2 x 2: NC 0,0
SSOP-20 = smd 1.2 x 0.4: 1 -3.5,2.925; 2 -3.5,2.275; 3 -3.5,1.625; 4 -3.5,0.975; 5 -3.5,0.325; 6 -3.5,-0.325; 7 -3.5,-0.975; 8 -3.5,-1.625; 9 -3.5,-2.275; 10 -3.5,-2.925; 11 3.5,-2.925; 12 3.5,-2.275; 13 3.5,-1.625; 14 3.5,-0.975; 15 3.5,-0.325; 16 3.5,0.325; 17 3.5,0.975; 18 3.5,1.625; 19 3.5,2.275; 20 3.5,2.925
S-PVQFN-N14 = smd 0.28 x 0.85: 1 -0.75,1.725; 7 -0.75,-1.725; 8 0.75,-1.725; 14 0.75,1.725 | smd 0.85 x 0.28: 2 -1.725,1; 3 -1.725,0.5; 4 -1.725,0; 5 -1.725,-0.5; 6 -1.725,-1; 9 1.725,-1; 10 1.725,-0.5; 11 1.725,0; 12 1.725,0.5; 13 1.725,1 | smd 2.05 x 2.05: THERMALPAD 0,0
SR086 = smd 1.27 x 0.6: 1 -2.4,1.905; 2 -2.4,0.635; 3 -2.4,-0.635; 4 -2.4,-1.905; 5 2.4,-1.905; 6 2.4,-0.635; 7 2.4,0.635; 8 2.4,1.905 | smd 2.55 x 3.7: PAD 0,0
SOIC_8 = smd 2.2 x 0.6: 1 -2.6,1.905; 2 -2.6,0.635; 3 -2.6,-0.635; 4 -2.6,-1.905; 5 2.6,-1.905; 6 2.6,-0.635; 7 2.6,0.635; 8 2.6,1.905
FA-128 = smd 0.95 x 0.85: 1 -0.725,-0.575; 2 0.725,-0.575; 3 0.725,0.575; 4 -0.725,0.575
FC-12M = smd 0.7 x 1.4: 1 -0.75,0; 2 0.75,0
CSM-7X = smd 5.5 x 2: 1 -4.75,0; 2 4.75,0

### Placement (x,y rotation side)
A1  8.12,11.43 90 top
B1  9.51,16.89 270 top
C1  2.54,20.95 0 top
C2  2.54,17.27 180 top
C3  18.16,21.08 0 top
C4  18.16,22.1 0 top
C5  33.27,44.58 270 top
C6  19.81,41.02 180 top
C7  13.21,19.3 270 top
C8  36.2,40.26 180 top
C9  51.82,32.38 90 top
C10  43.81,33.4 90 top
C11  5.84,18.41 270 top
C12  7.49,32.05 90 top
C13  4.32,30.23 90 top
C14  2.16,24 180 top
C15  6.99,18.41 270 top
C16  11.68,19.3 270 top
C17  14.61,20.95 0 top
C18  1.65,22.48 90 top
C19  4.9,33.83 270 top
C20  27.18,30.48 270 top
C21  33.02,30.48 270 top
C22  31.5,40.39 90 top
C23  42.8,7.75 180 top
C24  33.02,6.73 90 top
C25  14.45,29.87 90 top
C26  13.36,29.87 90 top
C27  4.7,18.41 270 top
C28  32.89,3.81 0 top
C29  42.29,3.05 270 top
C30  28.96,30.48 270 top
C31  32.77,33.53 0 top
C32  33.27,40.39 90 top
C33  28.96,10.41 180 top
C34  50.04,5.46 90 top
D1  65.28,23.53 270 top
D2  66.55,10.67 90 top
D3  33.78,20.32 0 top
D4  2.03,26.16 270 top
D5  2.03,27.43 270 top
D6  24,23.53 0 top
J2  20.32,27.94 90 top
J3  45.59,42.93 90 top
J4  52.7,42.93 90 top
J5  63.96,23.53 180 top
K1  38.61,24.89 270 top
L1  46.48,28.96 0 top
L2  58.42,34.42 180 top
L3  37.85,44.83 180 top
Q1  53.34,14.61 270 top
Q2  33.78,16.13 0 top
R1  64.64,36.2 90 top
R2  30.99,30.48 270 top
R3  33.78,24.13 90 top
R4  2.16,25.02 180 top
R5  2.16,28.57 180 top
R6  24,21.21 90 top
R7  36.2,42.29 0 top
R8  54.36,32.38 270 top
R9  46.48,33.4 270 top
R10  2.11,30.4 0 top
R11  2.67,22.48 270 top
R12  11.43,33.86 270 top
R13  4.9,35.69 270 top
R14  11.43,36.63 270 top
R15  26.67,18.92 0 top
R16  25.4,30.48 90 top
R17  36.32,3.81 0 top
R18  14.35,19.3 270 top
R19  31.24,16 270 top
R20  39.37,2.67 0 top
R21  59.69,10.79 0 top
R22  59.69,7.62 180 top
R23  49.15,32.38 90 top
R24  41.78,11.81 0 top
R25  36.45,11.81 0 top
S1  26.67,23.53 270 top
TP1  12.7,39.37 0 top
TP2  10.03,39.37 0 top
TP3  7.37,39.37 0 top
TP4  15.37,39.37 0 top
TP5  32.26,36.7 0 top
TP6  35.05,36.7 0 top
TP7  37.85,36.7 0 top
U1  8.51,25.02 270 top
U2  DS2411  [SOT-23']  2.11,32.56 180 top
U3  8.13,35.69 90 top
U4  26.04,36.96 180 top
U5  19.05,34.67 0 top
U6  37.21,7.24 0 top
U7  28.45,4.95 270 top
U$3  16.64,1.02 0 top
X1  2.54,19.18 270 top
X2  16.38,21.84 90 top
X3  24.13,44.32 0 top

### Tracks (layer width: path | path; a pad name or v marks a point on that pad's centre or on a via)
3V3  (via drill 0.2, 0.76)
  Top 0.254: U1.36 8.76,18.92 8.43,18.59 7.24,18.59 C15.1 C11.1 | U1.33 7.26,20.34 6.02,19.1 C11.1 | C16.1 11.12,19.74 10.92,19.94 | 10.92,19.94 10.76,20.1 | 10.76,20.1 U1.40 | U1.41 11.26,20.28 10.92,19.94 | U1.39 10.26,20.6 10.76,20.1 | U1.55 13.54,27.77 14.45,28.68 C25.1 | U1.10 7.26,31.39 C12.1 8,31.62 v8.38,32 | v6.1,33.15 6.1,34.24 U3.8 6.17,34.27 C19.1 R13.2 | v5.4,19.58 5.84,19.14 C11.1 | S1.P$1 S1.P$3 | S1.P$3 25.58,20.78 R6.1 23.67,20.78 22.48,21.97 v22.48,22.61 | R19.1 v31.24,18.03 | v26.67,19.81 25.8,20.68 S1.P$3 | U1.24 3.58,23.77 v3.43,23.62 3.05,24 C14.1 | R12.2 11.73,33.42 12.01,33.71 12.01,35.61 R14.2
  Top 0.406: U1.43 12.71,21.64 v13.59,21.64 | U1.15 4.32,28.39 C13.1
  Top 0.508: U5.8 18.6,31.75 v16.51,31.75 | C25.1 14.83,29.44 v15.24,29.84 | v10.79,32.64 11.43,33.27 R12.2 | 2.54,30.1 v3.43,29.21 3.73,29.21 C13.1 | 2.54,30.1 R10.2 2.54,31.04 U2.2 | C7.1 v12.45,19.74 C16.1 | v13.59,21.64 13.79,21.64 14.17,21.26 C17.1 | 2.54,30.1 2.54,28.63 R5.1 | R4.1 C14.1 | v17.78,37.34 17.78,36.92 U5.1
  Top 0.762: U6.4 33.57,5.33 C24.1 32.47,5.33 26.04,5.33 24.77,6.6 24.77,11.68 17.14,19.3 v16.13,19.3 | J2.1 21.21,26.92 v22.48,26.92 23.11,27.56 23.11,31.11 21.28,32.95 U5.8
  Bottom 0.254: v8.38,32 6.99,32 6.1,32.89 v6.1,33.15 | v3.43,23.62 2.54,22.73 2.54,21.46 4.42,19.58 v5.4,19.58 | v31.24,18.03 29.46,19.81 v26.67,19.81
  Bottom 0.508: v16.51,31.75 17.53,32.77 17.53,37.08 v17.78,37.34 | v16.51,31.75 11.68,31.75 v10.79,32.64 10.16,32 v8.38,32 5.71,29.34 3.56,29.34 v3.43,29.21 v3.43,23.62 | v16.13,19.3 15.7,19.74 | 15.7,19.74 v12.45,19.74 | v16.51,31.75 15.24,30.48 v15.24,29.84 | 15.7,19.74 13.79,21.64 v13.59,21.64
  Bottom 0.762: v16.13,19.3 19.18,19.3 v22.48,22.61 v22.48,26.92
5V0  (via drill 0.2)
  Top 0.305: U4.2
  Top 0.406: U4.2 25.39,34.68 v24.38,35.69 | v20.95,37.21 20.61,37.21 U5.14 | R16.1 25.48,29.63 C20.1 C30.1 29.29,31.33
  Top 0.508: U4.2 30.35,34.67 30.61,34.42 30.61,32.98 29.97,32.35 29.97,31.75 | R2.2 30.44,29.63 29.97,30.1 29.97,31.75 | 29.29,31.33 29.55,31.33 29.97,31.75
  Top 0.762: C33.1 29.84,10.93 29.84,25.02 30.99,26.16 | 30.99,26.16 R2.2 | R3.2 32.12,25.03 30.99,26.16
  Bottom 0.406: v24.38,35.69 22.48,35.69 v20.95,37.21
  pour Top (no thermals): 29.59,11.3 29.59,9.53 30.1,8.64 30.1,6.48 30.61,6.48 30.61,8.64 31.11,9.53 31.11,11.3
!ADE_CS  (via drill 0.2)
  Top 0.254: U1.53 13.94,26.77 16.38,29.21 16.38,30.48 14.15,32.72 14.15,34.59 15.49,35.94 16.51,35.94 | U5.2 16.78,35.67 16.51,35.94 | 16.51,35.94 16.51,36.7 v16.76,36.96
  Bottom 0.254: v16.76,36.96 16.76,37.97 TP4.TESTPOINT
!ADE_CS_5V
  Top 0.254: U4.17 21.09,35.98 U5.13
!ADE_IRQ
  Top 0.254: U4.14 16.9,37.93 13.72,34.75 13.72,32.38 15.88,30.23 15.88,29.34 13.81,27.27 U1.54
!ADE_RESET
  Top 0.406: U4.1 27.68,34.03 25.4,31.75 R16.2
!FRAM_CS
  Top 0.254: R12.1 10.11,34.29 U3.1 | 10.13,34.01 U3.1 | U3.1 10.13,32.11 8.26,30.23 U1.8
!FRAM_HOLD
  Top 0.254: U1.13 5.76,30.56 4.06,32.26 4.06,35.81 4.37,36.12 R13.1 5.03,36.12 5.94,35.21 U3.7
!FRAM_WP
  Top 0.254: U3.3 10.17,36.19 10.34,36.19 11.2,37.06 R14.1 11.96,37.06 12.42,36.6 12.42,32.69 11.76,32.03 10.82,32.03 8.76,29.97 U1.7
!RESET  (via drill 0.2)
  Top 0.254: v21.97,28.07 21.08,28.07 J2.3 | R11.1 3.23,22.91 v3.53,22.61
  Bottom 0.254: v21.97,28.07 21.46,28.57 14.99,28.57 13.34,30.23 12.32,30.23 10.79,28.7 4.7,28.7 4.19,28.19 4.19,23.24 3.56,22.61 v3.53,22.61
ADE_AVDD
  Top 0.406: U4.3 30.71,35.33 31.24,34.8 31.24,34.2 C31.1 31.92,31.5 31.75,31.33 | R2.1 31.75,31.33 | 31.75,31.33 C21.1
ADE_CF
  Top 0.254: U4.11 17.61,39.88 12.85,35.13 12.85,32.38 11.96,31.5 11.05,31.5 9.26,29.71 U1.6
ADE_ZX
  Top 0.254: U4.12 17.59,39.23 13.28,34.92 13.28,32.08 12.19,30.99 11.23,30.99 9.78,29.54 9.78,29.11 U1.5
ANTENNA
  pour Top (no thermals): 9.93,16.26 10.9,16.26 10.9,13.72 9.93,13.72
DC_RECTIFIED
  Top 1.778: Q1.P$2 44.83,14.61 43.18,12.96 R24.2
  pour Top (no thermals): 64.9,13.59 58.67,13.59 56.9,15.49 56.9,17.91 51.05,17.91 51.05,11.18 56.9,11.18 56.9,12.06 60.2,12.06 60.2,9.78 62.1,9.78 62.1,11.56 64.9,11.56
DS2411  (via drill 0.2)
  Top 0.254: R10.1 1.68,30.99 U2.1 1.19,31.62 v2.03,31.62 | U1.14 5.26,29.92 v5.08,30.1
  Bottom 0.254: v2.03,31.62 3.56,31.62 v5.08,30.1
GND  (via drill 0.2, 0.25, 0.51, 0.76)
  Top 0.254: C2.2 1.97,17.41 X1.2 1.97,18.6 3.12,19.75 X1.4 3.12,20.81 C1.2 | C12.2 7.72,32.49 8.26,33.02 | R15.1 24.64,18.92 v23.11,20.45
  Top 0.356: B1.5 7.87,16.89 | 7.87,16.89 7.37,16.89 6.99,17.27 C15.2 | B1.6 7.89,16.24 7.75,16.38 7.75,16.76 7.87,16.89 | B1.2 11.18,16.89 11.68,17.4 C16.2
  Top 0.508: v32.77,13.08 34.71,15.03 Q2.2
  Top 0.762: U6.3 36.58,6.6 U6.PAD | U6.2 34.52,7.58 C24.2 | C10.2 R9.1 46.48,35.31 46.23,35.56 | C9.2 51.82,35.05 51.31,35.56 46.23,35.56 | 35.3,40.02 C8.2 | C8.2 34.32,41.24 C32.2 | 46.23,35.56 42.04,35.56 39.5,38.1 37.45,38.1 C8.2
  Top 1.778: v26.29,12.95 v20.95,18.29
  other vias: 18.54,35.18 19.56,35.18 19.56,34.16 18.54,34.16 8.51,25.02 9.78,25.02 11.05,25.02 11.05,26.29 11.05,27.56 9.78,27.56 9.78,26.29 8.51,26.29 8.51,27.56 7.24,27.56 5.97,27.56 5.97,26.29 7.24,26.29 7.24,25.02 7.24,23.75 7.24,22.48 8.51,22.48 9.78,22.48 11.05,22.48 11.05,23.75 9.78,23.75 8.51,23.75 5.97,25.02 5.97,23.75 5.97,22.48 3.81,21.08 0.89,21.72 4.83,32.51 1.4,35.43 1.14,32.64 11.35,30.23 17.14,27.56 8.64,32.89 22.1,29.21 24.13,34.04 27.43,40.01 24.89,39.88 27.43,37.97 24.89,38.35 27.43,35.94 32.77,32.51 33.91,32.38 44.96,1.4 46.86,3.05 49.53,3.05 52.32,3.05 49.53,1.27 51.18,7.49 53.21,7.49 51.18,9.4 54.23,9.65 54.36,1.4 64.26,6.22 64.26,4.32 64.26,2.41 34.54,2.67 32.77,9.78 32.77,11.43 27.81,12.95 36.58,8.38 37.85,8.38 37.85,7.24 36.58,7.24 37.85,6.1 36.58,6.1 5.21,17.09 6.4,17.09 16.26,32.77 19.05,37.08 0.89,17.4 3.43,30.48 1.4,36.96 2.92,36.96 1.4,38.61 2.92,38.61 15.88,27.56 8,45.09 8,43.81 13.34,37.08 15.24,32.77 8,42.42 5.21,39.75 24,45.72 24,43.43 17.4,40.77 17.4,42.42 17.4,30.1 21.72,19.56 17.14,17.4 15.62,17.4 12.57,17.27 57.53,5.71 56.52,9.65 18.16,20.19
  pour Top: -1.27,48.26 34.29,48.26 34.29,39.12 29.08,39.12 29.08,35.56 34.29,35.56 34.29,28.32 24.13,28.32 24.13,20.32 20.07,16.76 11.3,16.89 11.3,21.59 7.75,21.59 7.75,16.76 -1.27,16.76
  pour Bottom: -1.27,14.73 17.65,14.73 24.13,20.32 24.13,28.32 34.29,28.32 34.29,35.56 29.08,35.56 29.08,39.12 34.29,39.12 34.29,48.26 -1.27,48.26
  pour Bottom: 67.31,-1.27 67.31,13.97 25.4,13.97 25.4,-1.27
  pour Top: 65.53,-1.27 65.53,9.27 62.74,9.27 62.74,8.13 59.18,8.13 59.18,10.67 50.16,10.67 50.16,4.06 44.07,4.06 44.07,2.79 41.4,2.79 41.4,-1.27
  pour Top: 33.02,4.95 33.02,2.29 38.99,2.29 38.99,3.43 40.26,4.83 40.26,5.59 38.48,5.59 38.48,9.65 35.94,9.65 35.94,8.38 33.66,8.38 33.66,13.97 31.75,13.97 31.75,5.97 28.7,5.97 28.7,13.97 25.4,13.97 25.4,-1.27 29.21,-1.27 29.21,4.95
GREEN_LED
  Top 0.254: D5.C 3.17,27.43 3.68,26.92 3.68,25.02 3.93,24.77 U1.22
LOAD_NEUTRAL
  Top 2.032: R1.2 63.11,37.47 55.24,37.47 52.7,40.01 | L3.P$1 40.01,44.77 40.01,40.13 42.8,37.34 50.04,37.34 52.7,40.01 | 52.7,40.01 J4.P$1
LOAD_PHASE
  Bottom 2.54: K1.1 41.77,32.49 45.59,36.32 J3.P$1
MISO  (via drill 0.2)
  Top 0.254: v11.43,35.18 10.17,35.18 U3.2 9.66,35.21 9.42,34.98 9.42,32.16 7.76,30.49 U1.9 | U5.4 16.76,34.67 16.51,34.42 v16.03,34.42
  Bottom 0.254: v11.43,35.18 12.19,34.42 v16.03,34.42 16.38,34.77 16.38,35.56 13.97,37.97 11.43,37.97 TP2.TESTPOINT
MISO_5V
  Top 0.254: U4.19 20.79,34.68 U5.11
MOSI  (via drill 0.2)
  Top 0.254: 6.83,32.89 6.83,36.88 6.6,37.11 U3.5 | U1.11 6.76,29.69 6.83,29.76 6.83,32.89 | v7.75,33.4 7.34,33.4 6.83,32.89 | U5.5 16.9,34.17 v16.38,33.66
  Bottom 0.254: v7.75,33.4 8,33.66 v16.38,33.66 16.89,34.16 16.89,35.94 13.46,39.37 TP1.TESTPOINT
MOSI_5V
  Top 0.254: U4.20 21.59,34.03 21.46,34.16 U5.10
N$1  (via drill 0.2)
  Top 0.254: U1.32 6.76,20.48 6.48,20.19 4.95,20.19 4.7,19.94 | U1.56 13.36,29.05 C26.1 12.6,29.44 v12.57,29.46 | 4.7,19.94 C27.1 | 4.7,19.94 4.7,20.32 v4.45,20.57
  Bottom 0.254: v4.45,20.57 4.83,20.95 4.83,27.94 5.08,28.19 11.3,28.19 v12.57,29.46
N$2
  Top 0.254: U1.28 2.79,21.77 R11.2 C18.1
N$3
  Top 0.305: X3.1 19.65,44.06
  Top 0.406: U4.15 23.57,37.28 23.88,37.59 23.88,40.26 23.11,41.02 C6.1 20.66,43.04 X3.1
N$4
  Top 0.762: D3.1 32.83,18.18 Q2.3 33.84,17.29 K1.4
N$6
  Top 0.254: U1.45 16.21,22.77 X2.2 16.88,22.1 C4.1
N$7
  Top 0.254: C3.1 16.39,21.08 | 16.39,21.08 X2.1 | 16.39,21.08 15.88,21.08 14.69,22.27 U1.44
N$8
  Top 0.254: R18.1 13.64,20.45 12.26,20.45 U1.42
N$9  (via drill 0.2)
  Top 0.254: C1.1 1.97,20.81 X1.1 1.93,19.94 v1.02,19.94 | v7.54,19.74 7.76,19.95 U1.34
  Bottom 0.254: v1.02,19.94 2.92,19.94 3.94,18.92 6.73,18.92 v7.54,19.74
N$10  (via drill 0.2)
  Top 0.254: X1.3 3.12,17.41 C2.1 3.23,17.53 v3.79,17.53 | U1.35 8.26,19.33 v8.15,19.23
  Bottom 0.254: v8.15,19.23 7.21,18.29 4.55,18.29 v3.79,17.53
N$11
  Top 0.406: C32.1 C22.1 31.19,39.23 U4.9
N$12
  Top 0.254: D6.A R6.2
N$13
  Top 0.762: R3.1 D3.3 37.02,21.42 K1.3
N$14
  Top 0.762: R8.1 55.49,34.42 L2.P$2
N$15
  Top 0.406: U4.16 24.82,36.63 25.91,37.72 25.91,41.35 X3.2 32.17,44.32 C5.1
N$16
  Top 0.762: L3.P$2 35.75,42.74 R7.1
N$17
  Top 0.762: L1.2 49.15,29.83 R23.1
N$18
  Top 1.016: R21.1 R22.2
N$20
  Top 0.508: D4.A 1.28,25.46 R4.2
N$21
  Top 1.778: R24.1 R25.2
N$22
  Top 0.508: D5.A 1.28,28.13 R5.2
N$24
  Top 0.762: C23.2 41.87,7.87 U6.7
N$26
  Top 0.508: U6.5 38.1,3.82 | 38.1,3.82 R17.2 | R20.1 38.52,3.4 38.1,3.82
RED_LED
  Top 0.254: U1.23 4.42,24.26 3.68,24.26 3.17,24.77 3.17,25.77 D4.C
RELAY_CTRL  (via drill 0.2)
  Top 0.254: v14.48,24.89 14.1,25.27 U1.50 | 32.71,15.15 32.64,15.22 v32.64,16.26 | v18.03,23.11 18.29,22.86 19.68,22.86 26.29,16.26 v28.45,16.26
  Top 0.762: Q2.1 32.71,15.15 R19.2
  Bottom 0.254: v18.03,23.11 16.13,24.89 v14.48,24.89 | v28.45,16.26 v32.64,16.26
RELAY_LED  (via drill 0.2)
  Top 0.254: D6.C 22.38,24.28 21.59,23.5 18.92,23.5 v18.29,24.13 | v15.11,25.65 15,25.77 U1.51
  Bottom 0.254: v18.29,24.13 16.76,25.65 v15.11,25.65
RF_N
  pour Top (no thermals): 9.61,20.95 9.61,17.36 10.91,17.36 10.91,17.72 arc-90 9.91,18.76 9.91,20.95
RF_P
  pour Top (no thermals): 9.12,20.95 9.12,18.69 arc-90 8.1,17.72 8.1,17.36 9.41,17.36 9.41,20.95
SCLK  (via drill 0.2)
  Top 0.254: U1.12 6.26,31.59 v5.97,31.88 | U5.3 16.88,35.19 v15.67,35.18 | v5.05,36.93 5.82,36.16 U3.6
  Bottom 0.254: v15.67,35.18 13.08,35.18 12.06,36.2 5.79,36.2 v5.05,36.93 | v5.97,31.88 5.46,32.38 5.46,36.52 v5.05,36.93 | v5.05,36.93 7.37,39.24 TP3.TESTPOINT
SCLK_5V
  Top 0.254: U4.18 21.49,35.33 21.34,35.18 U5.12
SR086_GATE  (via drill 0.51)
  Top 0.762: Q1.P$1 44.21,16.91 v42.93,15.62 | U6.8 42.04,9.14 v42.93,10.03
  Bottom 0.762: v42.93,15.62 v42.93,10.03
SR086_VIN
  pour Top (no thermals): 35.94,12.57 34.16,12.57 34.16,8.89 35.43,8.89 35.43,9.53 35.94,11.05
TCK
  Top 0.254: J2.4 15.51,23.77 U1.47
TDO
  Top 0.254: J2.6 18.8,28.32 18.8,27.81 15.25,24.27 U1.48
TMS
  Top 0.254: J2.2 19.13,26.67 15.72,23.27 U1.46
USER_RELAY_CTRL  (via drill 0.2)
  Top 0.254: v18.54,25.15 19.63,24.05 21.39,24.05 24.77,27.43 26.8,27.43 27.58,26.65 S1.P$2 S1.P$4 27.52,20.93 R15.2 | v15.75,26.54 15.47,26.27 U1.52
  Bottom 0.254: v18.54,25.15 17.14,26.54 v15.75,26.54
V1N
  Top 0.406: C9.1 50.92,32.38 48.26,32.38 46.35,30.48 37.21,30.48 36.2,31.5 36.2,35.56 TP6.TESTPOINT 33.91,37.85 31.55,37.85 30.99,37.28 | 30.99,37.28 U4.6 | U4.5 30.34,36.63 30.99,37.28
  Top 0.762: C9.1 R8.2
V1P  (via drill 0.41)
  Top 0.406: v38.1,39.12 37.09,40.12 C8.1 | U4.4 31.54,35.98 | TP5.TESTPOINT 31.54,35.98 | 31.54,35.98 33.87,35.98 34.8,35.05 v35.18,35.05
  Top 0.762: R7.2 C8.1
  Bottom 0.406: v38.1,39.12 36.45,37.47 36.45,36.32 v35.18,35.05
V2P
  Top 0.406: C10.1 43.32,32.5 39.12,36.7 TP7.TESTPOINT 37.21,36.7 35.31,38.61 31.24,38.61 30.57,37.93 U4.7
  Top 0.762: C10.1 R9.2 47.27,33.28 R23.2
VDC
  pour Top (no thermals): 48.39,13.34 48.39,4.57 43.43,4.57 43.43,3.43 40.89,3.43 40.89,0.89 29.97,0.89 29.97,3.43 31.5,4.32 32.51,4.32 32.51,1.78 39.5,1.78 39.5,3.17 40.89,4.57 40.89,6.22 38.99,6.22 38.99,6.99 43.05,6.99 43.05,8.26 44.96,8.26 44.96,13.34
WALL_NEUTRAL
  Top 1.27: D2.2 70.61,13.92 70.61,25.66 J5.NEUTRAL1
  Top 2.032: 65.33,25.6 D1.CATHODE 65.28,28.06 J5.NEUTRAL1 | L2.P$1 63.62,34.42 R1.1 64.64,31.63 J5.NEUTRAL1 | J5.NEUTRAL2 J5.NEUTRAL1
WALL_PHASE
  Top 1.27: L1.1 40.15,28.96 K1.2 | D2.1 68.6,8.62 66.75,10.47 J5.PHASE1
  Top 2.032: D1.ANODE 65.28,19.01 J5.PHASE1 J5.PHASE2
  Bottom 2.032: 38.63,27.41 K1.2
  Bottom 2.54: K1.2 48.48,17.54 J5.PHASE2

### Text on the board
tPlace: CLK | MI | MO | !ACS | P | N | V1P | VN | BLK | WHT | V2P | N | RELAY / CTRL | GRN | E | P | + | A | + | AC | me | Brad Campbell | 2014/01/08